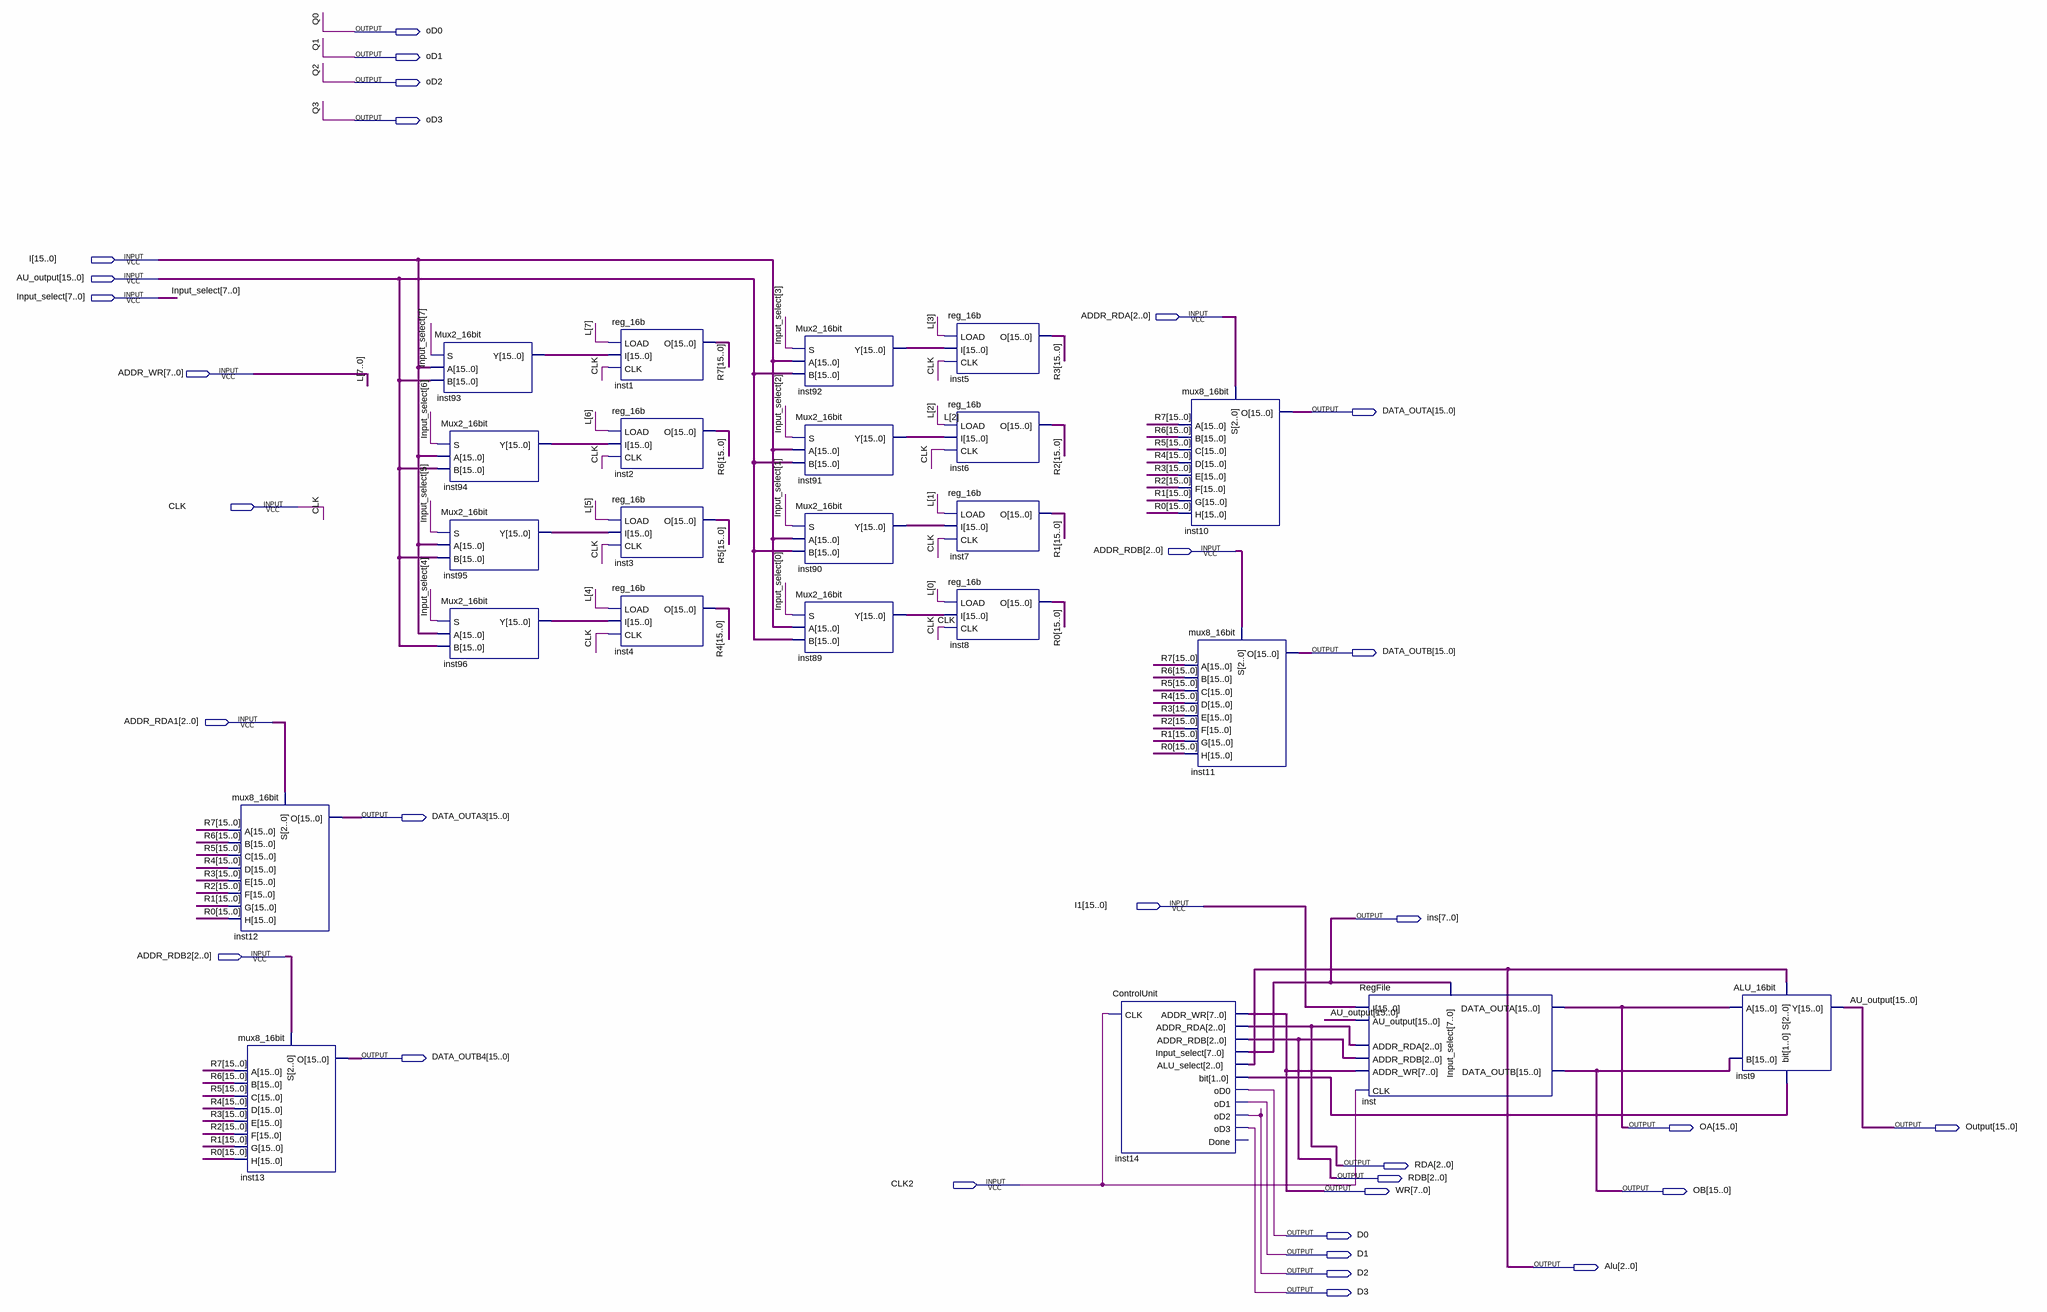
[diagram p0: schematic sheet]
// Quartus schematic nháp.bdf as structural Verilog: 23 symbols, 31 pins
module \nháp  (
  input  [15:0] I,
  input  [15:0] AU_output,
  input  [7:0] Input_select,
  input  [2:0] ADDR_RDA,
  input  [7:0] ADDR_WR,
  input  CLK,
  input  [2:0] ADDR_RDB,
  input  [2:0] ADDR_RDA1,
  input  [15:0] I1,
  input  [2:0] ADDR_RDB2,
  input  CLK2,
  output oD0,
  output oD1,
  output oD2,
  output oD3,
  output [15:0] DATA_OUTA,
  output [15:0] DATA_OUTB,
  output [15:0] DATA_OUTA3,
  output [7:0] ins,
  output [15:0] DATA_OUTB4,
  output [15:0] OA,
  output [15:0] Output,
  output [2:0] RDA,
  output [2:0] RDB,
  output [7:0] WR,
  output [15:0] OB,
  output D0,
  output D1,
  output [2:0] Alu,
  output D2,
  output D3
);

  wire [1:0] inst14_bit;
  wire [15:0] inst89_y, inst90_y, inst91_y, inst92_y, inst93_y, inst94_y, inst95_y, inst96_y, R0, R1, R2, R3,
       R4, R5, R6, R7;

  mux8_16bit inst12 (.S(ADDR_RDA1), .A(R7), .B(R6), .C(R5), .D(R4), .E(R3), .F(R2), .G(R1), .H(R0), .O(DATA_OUTA3));
  mux8_16bit inst13 (.S(ADDR_RDB2), .A(R7), .B(R6), .C(R5), .D(R4), .E(R3), .F(R2), .G(R1), .H(R0), .O(DATA_OUTB4));
  Mux2_16bit inst93 (.S(Input_select[7]), .A(I), .B(AU_output), .Y(inst93_y));
  Mux2_16bit inst94 (.S(Input_select[6]), .A(I), .B(AU_output), .Y(inst94_y));
  Mux2_16bit inst95 (.S(Input_select[5]), .A(I), .B(AU_output), .Y(inst95_y));
  Mux2_16bit inst96 (.S(Input_select[4]), .A(I), .B(AU_output), .Y(inst96_y));
  reg_16b inst1 (.LOAD(ADDR_WR[7]), .I(inst93_y), .CLK(CLK), .O(R7));
  reg_16b inst2 (.LOAD(ADDR_WR[6]), .I(inst94_y), .CLK(CLK), .O(R6));
  reg_16b inst3 (.LOAD(ADDR_WR[5]), .I(inst95_y), .CLK(CLK), .O(R5));
  reg_16b inst4 (.LOAD(ADDR_WR[4]), .I(inst96_y), .CLK(CLK), .O(R4));
  Mux2_16bit inst92 (.S(Input_select[3]), .A(I), .B(AU_output), .Y(inst92_y));
  Mux2_16bit inst91 (.S(Input_select[2]), .A(I), .B(AU_output), .Y(inst91_y));
  Mux2_16bit inst90 (.S(Input_select[1]), .A(I), .B(AU_output), .Y(inst90_y));
  Mux2_16bit inst89 (.S(Input_select[0]), .A(I), .B(AU_output), .Y(inst89_y));
  reg_16b inst5 (.LOAD(ADDR_WR[3]), .I(inst92_y), .CLK(CLK), .O(R3));
  reg_16b inst6 (.LOAD(ADDR_WR[2]), .I(inst91_y), .CLK(CLK), .O(R2));
  reg_16b inst7 (.LOAD(ADDR_WR[1]), .I(inst90_y), .CLK(CLK), .O(R1));
  reg_16b inst8 (.LOAD(ADDR_WR[0]), .I(inst89_y), .CLK(CLK), .O(R0));
  ControlUnit inst14 (
    .CLK(CLK2), .ADDR_WR(WR), .ADDR_RDA(RDA), .ADDR_RDB(RDB), .Input_select(ins), .ALU_select(Alu),
    .\bit (inst14_bit), .oD0(D0), .oD1(D1), .oD2(D2), .oD3(D3));  // open: Done
  mux8_16bit inst10 (.S(ADDR_RDA), .A(R7), .B(R6), .C(R5), .D(R4), .E(R3), .F(R2), .G(R1), .H(R0), .O(DATA_OUTA));
  mux8_16bit inst11 (.S(ADDR_RDB), .A(R7), .B(R6), .C(R5), .D(R4), .E(R3), .F(R2), .G(R1), .H(R0), .O(DATA_OUTB));
  RegFile inst (
    .I(I1), .AU_output(AU_output), .Input_select(ins), .ADDR_RDA(RDA), .ADDR_WR(WR), .CLK(CLK2),
    .ADDR_RDB(RDB), .DATA_OUTA(OA), .DATA_OUTB(OB));
  ALU_16bit inst9 (.S(Alu), .A(OA), .B(OB), .\bit (inst14_bit), .Y(AU_output));

  assign Output = AU_output;

  // Other names for the same wires on the sheet: L[7:0] = ADDR_WR; Q0 = oD0; Q1 = oD1; Q2 = oD2; Q3 = oD3
endmodule
